# EAGLE design v2 (EAGLE 9.2.2)

## Sheet 1 of 7
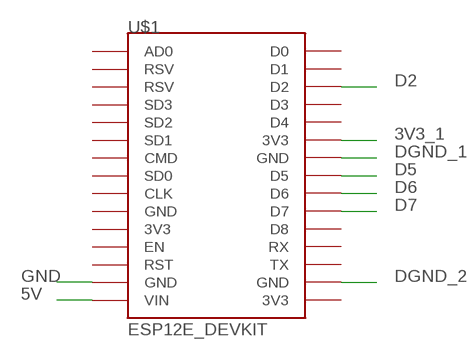
[diagram p0: schematic, sheet 1]

### Parts
U$1  ESP12E_DEVKIT  [ESP12E_DEVKIT]

### Nets
3V3_1: U$1.3V3@1(3V3) ; also sheet 2
5V: U$1.VIN ; also sheet 3
D2: U$1.D2 ; also sheet 2
D5: U$1.D5 ; also sheet 4
D6: U$1.D6 ; also sheet 5
D7: U$1.D7 ; also sheet 6
DGND_1: U$1.GND@2(GND) ; also sheet 2
DGND_2: U$1.GND@3(GND) ; also sheet 4,5,6
GND: U$1.GND@1(GND) ; also sheet 2,3
Unconnected: U$1.3V3@0(3V3) U$1.3V3@2(3V3) U$1.AD0 U$1.CLK U$1.CMD U$1.D0 U$1.D1 U$1.D3 U$1.D4 U$1.D8 U$1.EN U$1.GND@0(GND) U$1.RST U$1.RSV@0(RSV) U$1.RSV@1(RSV) U$1.RX U$1.SD0 U$1.SD1 U$1.SD2 U$1.SD3 U$1.TX

## Sheet 2 of 7
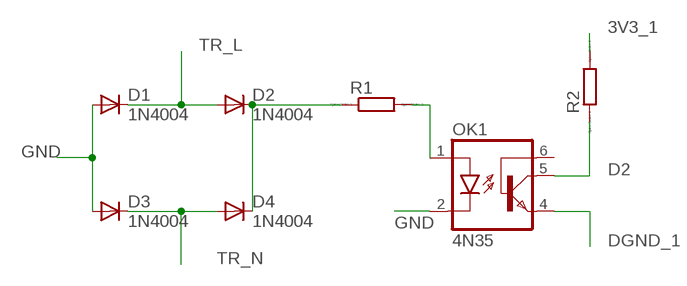
[diagram p1: schematic, sheet 2]

### Parts
D1  1N4004  [DO41-10]
D2  1N4004  [DO41-10]
D3  1N4004  [DO41-10]
D4  1N4004  [DO41-10]
OK1  4N35  [DIL06]
R1  R0204/7  [0204/7]
R2  R0204/7  [0204/7]

### Nets
3V3_1: R2.2 ; also sheet 1
D2: OK1.5(COL) R2.1 ; also sheet 1
DGND_1: OK1.4(EMI) ; also sheet 1
GND: D1.A D3.A OK1.2(C) ; also sheet 1,3
N$1: D2.C D4.C R1.1
N$5: OK1.1(A) R1.2
TR_L: D1.C D2.A ; also sheet 3
TR_N: D3.C D4.A ; also sheet 3
Unconnected: OK1.6(BAS)

## Sheet 3 of 7
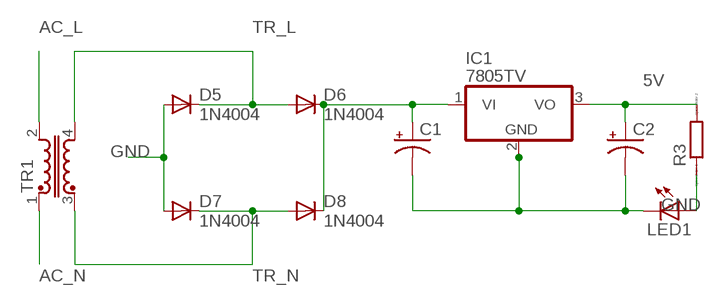
[diagram p2: schematic, sheet 3]

### Parts
C1  CPOL-USE5-13  [E5-13]
C2  CPOL-USE5-13  [E5-13]
D5  1N4004  [DO41-10]
D6  1N4004  [DO41-10]
D7  1N4004  [DO41-10]
D8  1N4004  [DO41-10]
IC1  7805TV  [TO220V]
LED1  LED3MM  [LED3MM]
R3  R0204/7  [0204/7]
TR1  U15-TRANSFORMER  [U15]

### Nets
5V: C2.+ IC1.3(VO) R3.2 ; also sheet 1
AC_L: TR1.2 ; also sheet 4,5,6,7
AC_N: TR1.1 ; also sheet 7
GND: C1.- C2.- D5.A D7.A IC1.2(GND) LED1.K(C) ; also sheet 1,2
N$2: C1.+ D6.C D8.C IC1.1(VI)
N$3: LED1.A R3.1
TR_L: D5.C D6.A TR1.4 ; also sheet 2
TR_N: D7.C D8.A TR1.3 ; also sheet 2

## Sheet 4 of 7
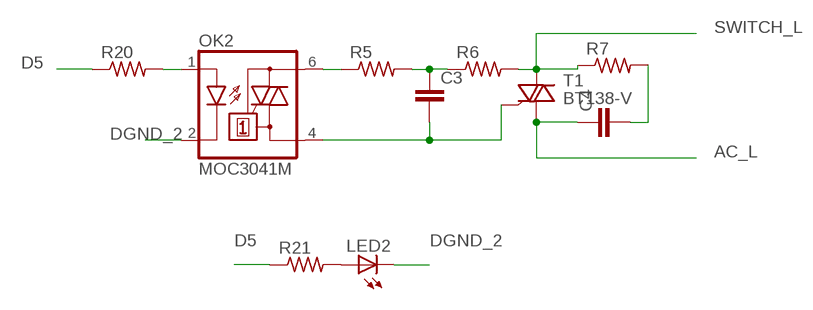
[diagram p3: schematic, sheet 4]

### Parts
C3  C7.5/3  [C7.5B3]
C4  C7.5/3  [C7.5B3]
LED2  LED3MM  [LED3MM]
OK2  MOC3041M  [DIL06]
R5  R-US_0207/10  [0207/10]
R6  R-US_0207/10  [0207/10]
R7  R-US_0207/10  [0207/10]
R20  R-US_0207/10  [0207/10]
R21  R-US_0207/10  [0207/10]
T1  BT138-V  [TO220BV]

### Nets
AC_L: C4.1 T1.T1(A1) ; also sheet 3,5,6,7
D5: R20.1 R21.1 ; also sheet 1
DGND_2: LED2.K(C) OK2.2(C) ; also sheet 1,5,6
N$4: OK2.6(A2) R5.1
N$6: C3.2 OK2.4(A1) T1.G
N$7: OK2.1(A) R20.2
N$8: C3.1 R5.2 R6.1
N$11: C4.2 R7.2
N$19: LED2.A R21.2
SWITCH_L: R6.2 R7.1 T1.T2(A2) ; also sheet 7

## Sheet 5 of 7
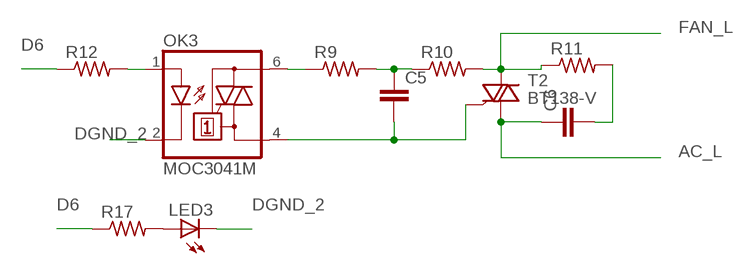
[diagram p4: schematic, sheet 5]

### Parts
C5  C7.5/3  [C7.5B3]
C6  C7.5/3  [C7.5B3]
LED3  LED3MM  [LED3MM]
OK3  MOC3041M  [DIL06]
R9  R-US_0207/10  [0207/10]
R10  R-US_0207/10  [0207/10]
R11  R-US_0207/10  [0207/10]
R12  R-US_0207/10  [0207/10]
R17  R-US_0207/10  [0207/10]
T2  BT138-V  [TO220BV]

### Nets
AC_L: C6.1 T2.T1(A1) ; also sheet 3,4,6,7
D6: R12.1 R17.1 ; also sheet 1
DGND_2: LED3.K(C) OK3.2(C) ; also sheet 1,4,6
FAN_L: R10.2 R11.1 T2.T2(A2) ; also sheet 7
N$9: C5.2 OK3.4(A1) T2.G
N$10: OK3.1(A) R12.2
N$12: OK3.6(A2) R9.1
N$13: C5.1 R9.2 R10.1
N$14: C6.2 R11.2
N$21: LED3.A R17.2

## Sheet 6 of 7
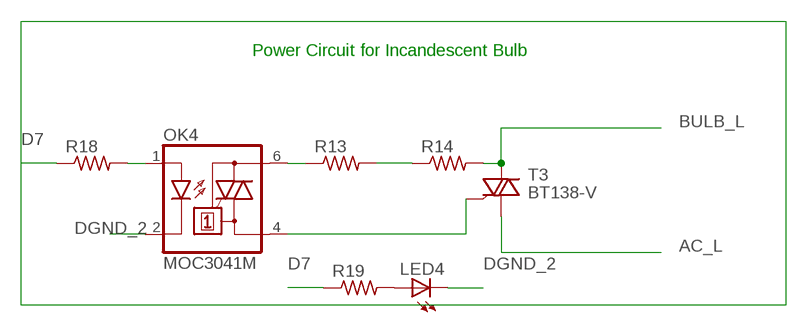
[diagram p5: schematic, sheet 6]

### Parts
LED4  LED3MM  [LED3MM]
OK4  MOC3041M  [DIL06]
R13  R-US_0207/10  [0207/10]
R14  R-US_0207/10  [0207/10]
R18  R-US_0207/10  [0207/10]
R19  R-US_0207/10  [0207/10]
T3  BT138-V  [TO220BV]

### Nets
AC_L: T3.T1(A1) ; also sheet 3,4,5,7
BULB_L: R14.2 T3.T2(A2) ; also sheet 7
D7: R18.1 R19.1 ; also sheet 1
DGND_2: LED4.K(C) OK4.2(C) ; also sheet 1,4,5
N$15: OK4.4(A1) T3.G
N$16: OK4.1(A) R18.2
N$17: OK4.6(A2) R13.1
N$18: R13.2 R14.1
N$22: LED4.A R19.2

### Notes on the sheet
- Power Circuit for Incandescent Bulb

## Sheet 7 of 7
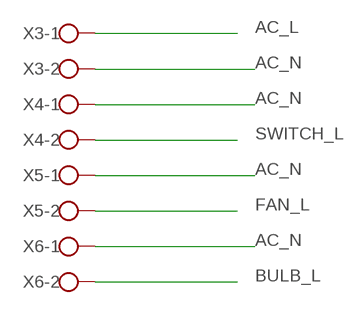
[diagram p6: schematic, sheet 7]

### Parts
X3  W237-102  [W237-102]
X4  W237-102  [W237-102]
X5  W237-102  [W237-102]
X6  W237-102  [W237-102]

### Nets
AC_L: X3.1 ; also sheet 3,4,5,6
AC_N: X3.2 X4.1 X5.1 X6.1 ; also sheet 3
BULB_L: X6.2 ; also sheet 6
FAN_L: X5.2 ; also sheet 5
SWITCH_L: X4.2 ; also sheet 4

## Library data of the parts
C1 C2 = rcl:CPOL-US: POLARIZED CAPACITOR, American symbol; SPICEPREFIX: C
C3-C6 = capacitor-wima:C: CAPACITOR naming: grid - package width
D1-D8 = adafruit:1N4004: DIODE General purpose 1N400x type rectifier (With bigger pads) http://www.ladyada.net/library/pcb/eaglelibrary.html
IC1 = linear:78*: Positive VOLTAGE REGULATOR Source: http://cache.national.com/ds/LM/LM78L05.pdf http://www.fairchildsemi.com/ds/LM/LM7805.pdf
LED1-LED4 = adafruit:LED: LED OSRAM: - CHIPLED LG R971, LG N971, LY N971, LG Q971, LY Q971, LO R971, LY R971 LH N974, LH R974 LS Q976, LO Q976, LY Q976 LO Q996 - Hyper CHIPLED LW Q18S LB Q993, LB Q99A, LB R99A - SideLED LS A670, LO A670, LY A670, LG A670, LP A670 LB A673, LV A673, LT A673, LW A673 LH A674 LY A675 LS A676, LA A676, LO A676, LY A676, LW A676 LS A679, LY A679, LG A679 - Hyper Micro SIDELED® LS Y876, LA Y876, LO Y876, LY Y876 LT Y87S - SmartLED LW L88C, LW L88S LB L89C, LB L89S, LG L890 LS L89K, LO L89K, LY L89K LS L896, LA L896, LO L896, LY L896 - TOPLED LS T670, LO T670, LY T670, LG T670, LP T670 LSG T670, LSP T670, LSY T670, LOP T670, LYG T670 LG T671, LOG T671, LSG T671 LB T673, LV T673, LT T673, LW T673 LH T674 LS T676, LA T676, LO T676, LY T676, LB T676, LH T676, LSB T676, LW T676 LB T67C, LV T67C, LT T67C, LS T67K, LO T67K, LY T67K, LW E67C LS E67B, LA E67B, LO E67B, LY E67B, LB E67C, LV E67C, LT E67C LW T67C LS T679, LY T679, LG T679 LS T770, LO T770, LY T770, LG T770, LP T770 LB T773, LV T773, LT T773, LW T773 LH T774 LS E675, LA E675, LY E675, LS T675 LS T776, LA T776, LO T776, LY T776, LB T776 LHGB T686 LT T68C, LB T68C - Hyper Mini TOPLED® LB M676 - Mini TOPLED Santana® LG M470 LS M47K, LO M47K, LY M47K Source: http://www.osram.convergy.de/
OK1 = optocoupler:4N35: MOTOROLA OPTO COUPLER; MF: FAIRCHILD SEMICONDUCTOR; MPN: 4N35; OC_FARNELL: 1328375; OC_NEWARK: 72K9946
OK2-OK4 = optocoupler:MOC30*: 6-Pin DIP Zero-Cross Optoisolators Triac Driver Output (250/400 Volt Peak) Source: Data sheet <http://www.fairchildsemi.com/ds/MO/MOC3031M.pdf> The old path of data sheet not more available 2013-05-06.; MF: FAIRCHILD SEMICONDUCTOR; MPN: MOC3041M; OC_FARNELL: 1086677; OC_NEWARK: 78K6090
R1-R3 = eagle-ltspice:R: RESISTOR, European symbol; SPICEMODEL: NONE; SPICEPREFIX: R
R5-R7 R9-R14 R17-R21 = adafruit:R-US_: RESISTOR, American symbol
T1-T3 = triac:BT138: TRIAC Source: http://www.semiconductors.philips.com BT138_SERIES_2.pdf
TR1 = inductor-neosid:U15: TRANSFORMER U15; OC_FARNELL: unknown; OC_NEWARK: unknown
U$1 = ESP12E_DEVKIT:ESP12E_DEVKIT: ESP12E DEVKIT BOARD
X3-X6 = con-wago-500:W237-102: WAGO SCREW CLAMP; MPN: 237-102; OC_FARNELL: unknown; OC_NEWARK: 70K9898

## Board
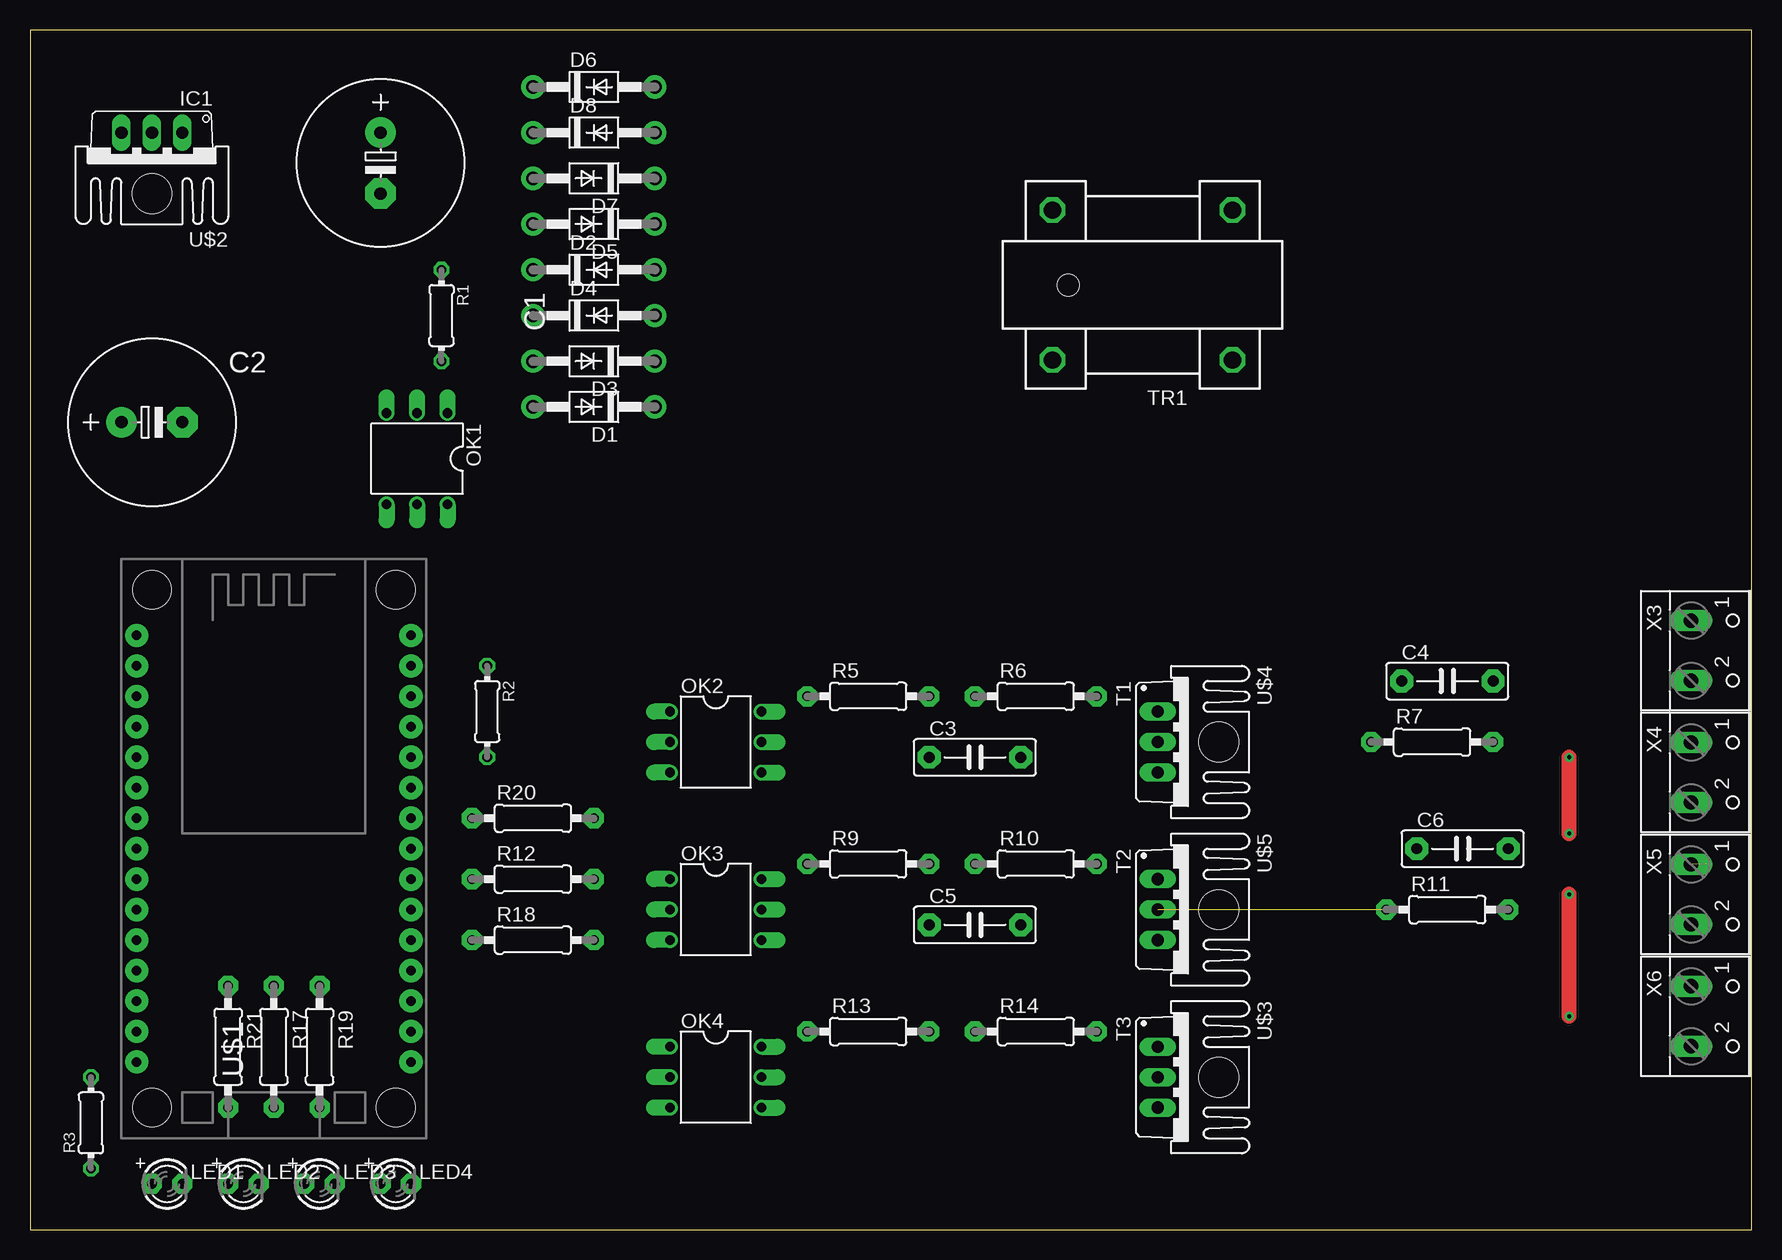
[diagram p7: board, top side]
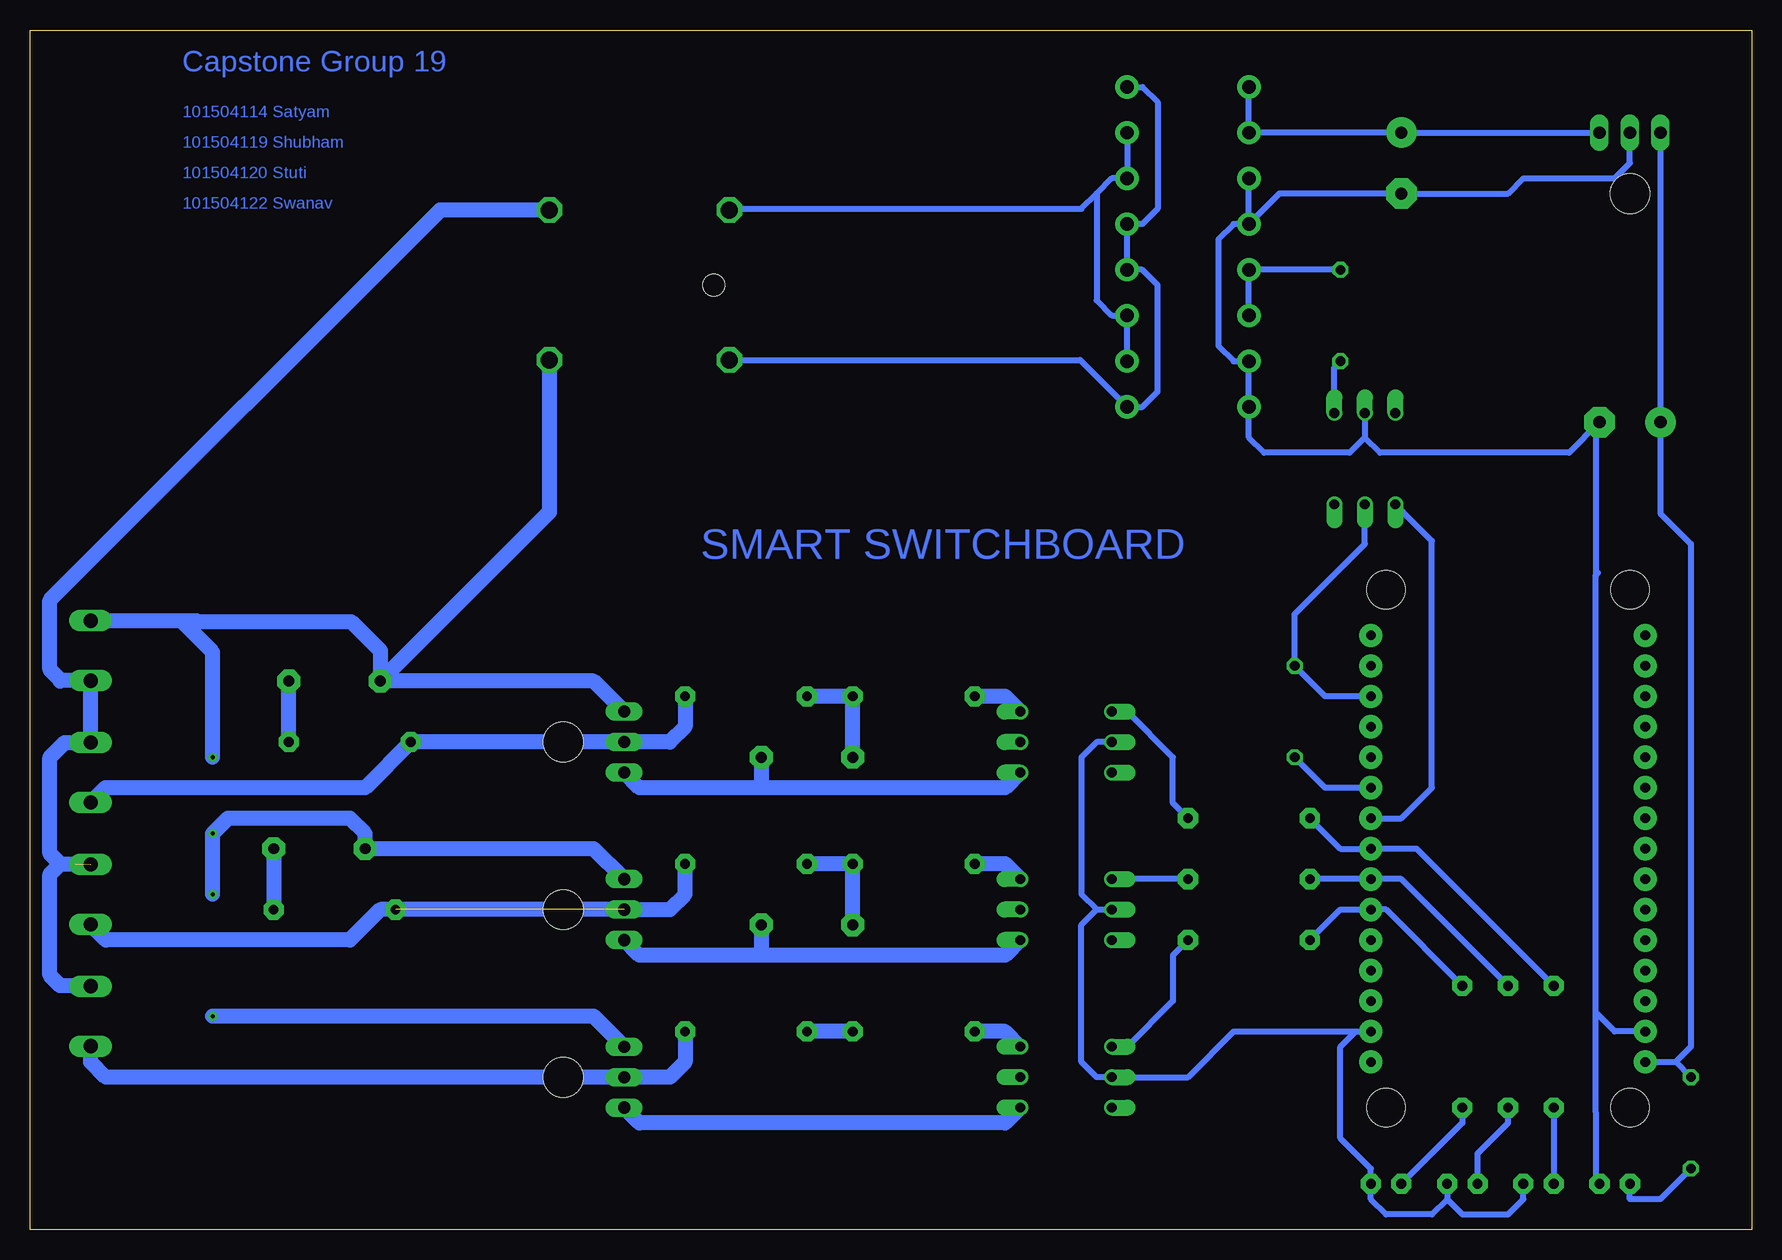
[diagram p8: board, bottom side, seen from below]

Size 143.49 x 100 mm. Coordinates in mm from the lower left corner, seen from the top.
Outline: 0,0 143.49,0 143.49,100 0,100 0,0
Copper layers (1*16): Top 0.035mm / dielectric 1.5mm / Bottom 0.035mm
Design rules "default": minimum track width 6mil, minimum drill 0.35mm, track to track 6mil, track to pad 6mil, pad to pad 6mil, via to via 6mil, smd to smd 6mil, copper to edge 40mil, drill to drill 6mil, minimum pad ring 10mil, minimum via ring 8mil, stop-mask expansion 4mil, vias tented up to drill 0mil, thermal gap 10mil

### Footprints (pad centres in the part's own frame; a part is rotated, then mirrored left to right if it is on the bottom)
E5-13 = drill 1.016 pad 2.54: + -2.54,0 | drill 1.016 pad 2.54 octagon: - 2.54,0
C7.5B3 = drill 0.914 pad 1.905 octagon: 1 -3.81,0; 2 3.81,0
DO41-10 = drill 1.118 pad 1.93: A 5.08,0; C -5.08,0
TO220V = drill 1.016 long: 1 -2.54,-2.54; 2 0,-2.54; 3 2.54,-2.54
LED3MM = drill 0.813 pad 1.676 octagon: A -1.27,0; K 1.27,0
DIL06 = drill 0.813 offset: 1 -2.54,-3.81; 2 0,-3.81; 3 2.54,-3.81; 4 2.54,3.81; 5 0,3.81; 6 -2.54,3.81
0204/7 = drill 0.813 octagon: 1 -3.81,0; 2 3.81,0
0207/10 = drill 0.813 pad 1.676 octagon: 1 -5.08,0; 2 5.08,0
TO220BV = drill 1.016 long: G 2.54,-2.54; T1 -2.54,-2.54; T2 0,-2.54
U15 = drill 1.422 octagon: 1 -7.5,-6.25; 2 -7.5,6.25; 3 7.5,-6.25; 4 7.5,6.25 | hole 1.8: 6.2,0
ESP12E_DEVKIT = drill 0.8 pad 1.93: 3V3@0 -11.43,-7.62; 3V3@1 11.43,5.08; 3V3@2 11.43,-17.78; AD0 -11.43,17.78; CLK -11.43,-2.54; CMD -11.43,2.54; D0 11.43,17.78; D1 11.43,15.24; D2 11.43,12.7; D3 11.43,10.16; D4 11.43,7.62; D5 11.43,0; D6 11.43,-2.54; D7 11.43,-5.08; D8 11.43,-7.62; EN -11.43,-10.16; GND@0 -11.43,-5.08; GND@1 -11.43,-15.24; GND@2 11.43,2.54; GND@3 11.43,-15.24; RST -11.43,-12.7; RSV@0 -11.43,15.24; RSV@1 -11.43,12.7; RX 11.43,-10.16; SD0 -11.43,0; SD1 -11.43,5.08; SD2 -11.43,7.62; SD3 -11.43,10.16; TX 11.43,-12.7; VIN -11.43,-17.78 | hole 3.2: -10.16,21.59; 10.16,21.59; 10.16,-21.59; -10.16,-21.59
SK95-2M3 = hole 3.302: 0,2.54
W237-102 = drill 1.194 long: 1 -2.5,-1.27; 2 2.5,-1.27

### Placement (x,y rotation side)
C1  29.21,88.9 270 top
C2  10.16,67.31 0 top
C3  78.74,39.37 0 top
C4  118.11,45.72 0 top
C5  78.74,25.4 0 top
C6  119.38,31.75 0 top
D1  46.99,68.58 180 top
D2  46.99,80.01 0 top
D3  46.99,72.39 180 top
D4  46.99,76.2 0 top
D5  46.99,83.82 180 top
D6  46.99,95.25 0 top
D7  46.99,87.63 180 top
D8  46.99,91.44 0 top
IC1  10.16,88.9 180 top
LED1  11.43,3.81 0 top
LED2  17.78,3.81 0 top
LED3  24.13,3.81 0 top
LED4  30.48,3.81 0 top
OK1  32.26,64.26 180 top
OK2  57.15,40.64 270 top
OK3  57.15,26.67 270 top
OK4  57.15,12.7 270 top
R1  34.29,76.2 270 top
R2  38.1,43.18 270 top
R3  5.08,8.89 90 top
R5  69.85,44.45 0 top
R6  83.82,44.45 0 top
R7  116.84,40.64 0 top
R9  69.85,30.48 0 top
R10  83.82,30.48 0 top
R11  118.11,26.67 0 top
R12  41.91,29.21 0 top
R13  69.85,16.51 0 top
R14  83.82,16.51 0 top
R17  20.32,15.24 270 top
R18  41.91,24.13 0 top
R19  24.13,15.24 270 top
R20  41.91,34.29 0 top
R21  16.51,15.24 270 top
T1  96.52,40.64 270 top
T2  96.52,26.67 270 top
T3  96.52,12.7 270 top
TR1  92.71,78.74 180 top
U$1  20.32,31.75 0 top
U$2  [SK95-2M3]  10.16,88.9 180 top
U$3  [SK95-2M3]  96.52,12.7 270 top
U$4  [SK95-2M3]  96.52,40.64 270 top
U$5  [SK95-2M3]  96.52,26.67 270 top
X3  139.7,48.26 270 top
X4  139.7,38.1 270 top
X5  139.7,27.94 270 top
X6  139.7,17.78 270 top

### Tracks (layer width: path | path; a pad name or v marks a point on that pad's centre or on a via)
3V3_1
  Bottom 0.508: U$1.3V3@1 35.56,36.83 R2.2
5V
  Bottom 0.508: U$1.VIN 6.35,13.97 | 6.35,13.97 5.08,15.24 5.08,57.15 7.62,59.69 C2.+ IC1.3 | R3.2 6.35,13.97
AC_L  (via drill 0.35)
  Top 1.27: v128.27,17.78 v128.27,27.94 | v128.27,33.02 v128.27,39.37
  Bottom 1.27: T1.T1 96.52,45.72 C4.1 | T2.T1 96.52,31.75 C6.1 115.57,33.02 116.84,34.29 127,34.29 v128.27,33.02 v128.27,27.94 | 129.54,50.68 130.81,50.68 128.27,48.14 v128.27,39.37 | 129.54,50.68 116.72,50.68 114.3,48.26 C4.1 | T3.T1 96.52,17.78 v128.27,17.78 | TR1.2 100.21,59.81 C4.1 | X3.1 129.62,50.76 129.54,50.68
AC_N  (1 unrouted)
  Bottom 1.27: TR1.1 109.32,84.99 141.84,52.47 141.84,46.67 140.93,45.76 | X6.1 138.47,20.32 140.97,20.32 141.84,21.19 141.84,29.61 140.97,30.48 | 140.97,30.48 139.7,30.48 | 140.97,30.48 141.84,31.35 141.84,39.37 140.61,40.6 X4.1 X3.2 140.93,45.76 | 140.93,45.76 140.97,45.72
BULB_L
  Bottom 1.27: R14.2 88.9,13.97 90.17,12.7 T3.T2 137.16,12.7 138.43,13.97 X6.2
D2
  Bottom 0.508: U$1.D2 35.56,44.45 R2.1 38.1,51.31 32.26,57.15 OK1.5
D5
  Bottom 0.508: R21.1 27.94,31.75 U$1.D5 34.29,31.75 R20.1
D6
  Bottom 0.508: R17.1 29.21,29.21 U$1.D6 R12.1
D7
  Bottom 0.508: R19.1 30.48,26.67 U$1.D7 34.29,26.67 R18.1
DGND_1
  Bottom 0.254: 29.08,59.82 OK1.4
  Bottom 0.508: U$1.GND@2 29.21,34.29 26.67,36.83 26.67,57.4 29.08,59.82
DGND_2
  Bottom 0.508: 33.02,16.51 43.18,16.51 46.99,12.7 OK4.2 54.61,12.7 55.88,13.97 55.88,25.4 54.61,26.67 | 33.02,16.51 U$1.GND@3 | 54.61,26.67 55.88,27.94 55.88,39.37 54.61,40.64 OK2.2 | 54.61,26.67 OK3.2 | LED2.K 19.05,2.54 20.32,1.27 24.13,1.27 25.4,2.54 | LED3.K 25.4,2.54 | 25.4,2.54 26.67,1.27 30.48,1.27 31.75,2.54 LED4.K 31.75,5.08 34.29,7.62 34.29,15.24 33.02,16.51
FAN_L  (1 unrouted)
  Bottom 1.27: R10.2 88.9,27.94 90.17,26.67 T2.T2 R11.1 114.3,26.67 116.84,24.13 137.16,24.13 138.43,25.4 X5.2
GND
  Bottom 0.508: OK1.2 32.26,66.04 | 32.26,66.04 33.53,64.77 40.64,64.77 41.91,66.04 D1.A D3.A 43.18,72.39 44.45,73.66 44.45,82.55 43.18,83.82 D5.A | D5.A D7.A | D5.A 39.37,86.36 C1.- 20.32,86.36 19.05,87.63 11.43,87.63 10.16,88.9 IC1.2 | U$1.GND@1 11.43,16.51 13.03,18.11 | 13.03,54.53 12.82,54.73 | 13.03,18.11 13.03,54.53 | 12.82,67.19 C2.- | C2.- 13.03,66.98 13.03,54.53 | C2.- 15.24,64.77 30.99,64.77 32.26,66.04 | 13.03,18.11 13.03,10.16 13.03,9.83 13.03,4.14 LED1.K
N$1
  Bottom 0.508: R1.1 D2.C D4.C
N$2
  Bottom 0.508: D6.C D8.C C1.+ IC1.1
N$3
  Bottom 0.508: R3.1 7.62,2.54 10.16,2.54 LED1.A
N$4
  Bottom 1.27: OK2.6 62.23,44.45 R5.1
N$5
  Bottom 0.508: OK1.1 34.8,71.88 R1.2
N$6
  Bottom 1.27: OK2.4 62.23,36.83 82.55,36.83 | 82.55,36.83 92.71,36.83 T1.G | C3.2 82.55,36.83
N$7
  Bottom 0.508: R20.2 48.26,35.56 48.26,39.37 52.07,43.18 OK2.1
N$8
  Bottom 1.27: R6.1 R5.2 C3.1
N$9
  Bottom 1.27: OK3.4 62.23,22.86 82.55,22.86 | T2.G 92.71,22.86 82.55,22.86 | C5.2 82.55,22.86
N$10
  Bottom 0.508: R12.2 OK3.1
N$11
  Bottom 1.27: R7.2 C4.2
N$12
  Bottom 1.27: OK3.6 62.23,30.48 R9.1
N$13
  Bottom 1.27: R10.1 R9.2 C5.1
N$14
  Bottom 1.27: C6.2 R11.2
N$15
  Bottom 1.27: OK4.4 62.23,8.89 92.71,8.89 T3.G
N$16
  Bottom 0.508: OK4.1 52.07,15.24 48.26,19.05 48.26,22.86 R18.2
N$17
  Bottom 1.27: OK4.6 62.23,16.51 R13.1
N$18
  Bottom 1.27: R13.2 R14.1
N$19
  Bottom 0.508: R21.2 LED2.A
N$21
  Bottom 0.508: LED3.A 22.86,6.35 20.32,8.89 R17.2
N$22
  Bottom 0.508: R19.2 24.13,8.89 LED4.A
SWITCH_L
  Bottom 1.27: R6.2 88.9,41.91 90.17,40.64 T1.T2 R7.1 115.57,36.83 137.2,36.83 X4.2
TR_L
  Bottom 0.508: D6.A 50.8,95.25 49.53,93.98 49.53,85.09 50.8,83.82 D5.C D2.A 50.8,80.01 49.53,78.74 49.53,69.85 50.8,68.58 D1.C 55.98,72.49 TR1.4
TR_N
  Bottom 0.508: D3.C D4.A 53.34,76.2 54.61,77.47 54.61,86.36 | D8.A D7.C 53.34,87.63 54.61,86.36 | TR1.3 85.11,85.09 55.88,85.09 54.61,86.36

### Text on the board
Bottom: Capstone Group 19 | 101504114 Satyam | 101504119 Shubham | 101504120 Stuti | 101504122 Swanav | SMART SWITCHBOARD